# Altium schematic sheet MCU025B_Hardware.SchDoc
size 431 x 279 mm; Date: Not shown in title block; ApprovedBy: Not shown in title block; CheckedBy: Not shown in title block; Author: Not shown in title block; CompanyName: Not shown in title block; Engineer: Not shown in title block; Organization: Not shown in title block; Address1: Not shown in title block; Address2: Not shown in title block; Address3: Not shown in title block; Address4: Not shown in title block; DocumentNumber: 8; Revision: Use project parameter SCH_Rev; SheetNumber: 8; SheetTotal: 8; PageSetup: Record=PageOptions|CenterHorizontal=True|CenterVertical=True|PrintScale=1.00|XCorrection=1.00|YCorrection=1.00|PrintKind=0|BorderSize=5000000|LeftOffset=0|BottomOffset=0|Orientation=2|PaperLength=1000|PaperWidth=1000|Scale=100|PaperSource=15|PrintQuality=600|MediaType=1|DitherType=10|PaperKind=Letter|PrintScaleMode=1; CurrentTime: Not shown in title block; CurrentDate: Not shown in title block; Time: Not shown in title block; DocumentFullPathAndName: Not shown in title block; DocumentName: Not shown in title block; ModifiedDate: Not shown in title block; ImagePath: Not shown in title block
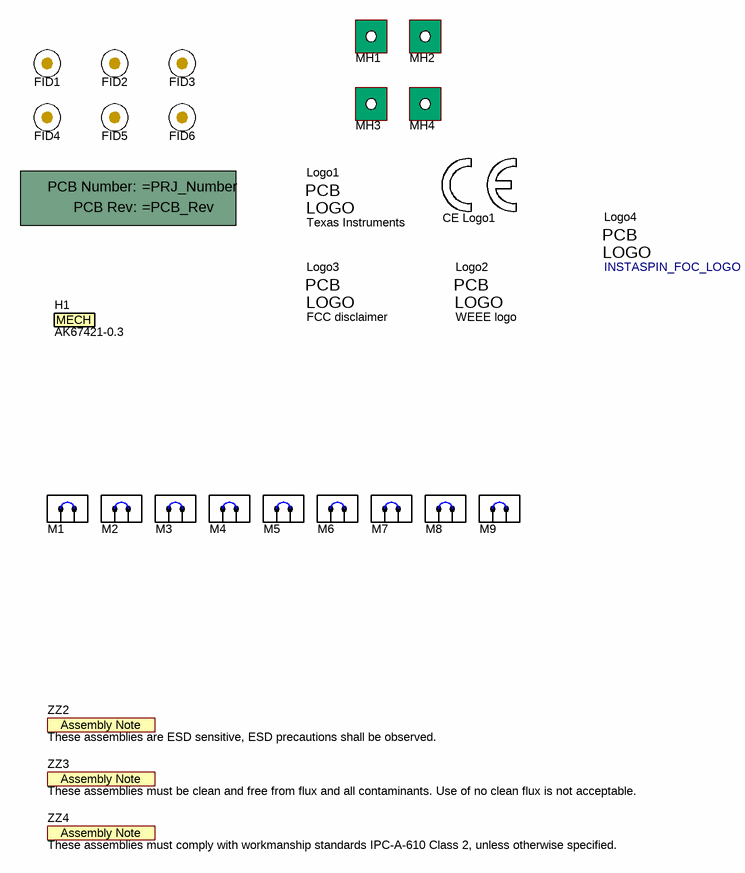
[diagram p0: MCU025B_Hardware.SchDoc]

## Parts
!PCB1  Printed Circuit Board  (value not drawn)  (mechanical)
CE_Logo1  CE Mark  [CE_Mark_5mm]  (value not drawn)  (no BOM)
FID1  Fiducial  [Fiducial10-20]  (value not drawn)  (no BOM)
FID2  Fiducial  [Fiducial10-20]  (value not drawn)  (no BOM)
FID3  Fiducial  [Fiducial10-20]  (value not drawn)  (no BOM)
FID4  Fiducial  [Fiducial10-20]  (value not drawn)  (no BOM)
FID5  Fiducial  [Fiducial10-20]  (value not drawn)  (no BOM)
FID6  Fiducial  [Fiducial10-20]  (value not drawn)  (no BOM)
H1  AK67421-0.3  (mechanical)
Logo1  Texas Instruments  [TI_Stacked_Overlay_Small]  (no BOM)
Logo2  WEEE logo  [WEEE_Minimum]  (no BOM)
Logo3  FCC disclaimer  [FCC_disclaimer]  (no BOM)
Logo4  INSTASPIN_FOC_LOGO  [INSTASPIN_FOC_LOGO]  (no BOM)
M1  60900213421  [Wurth_60900213421]  (value not drawn)
M2  60900213421  [Wurth_60900213421]  (value not drawn)
M3  60900213421  [Wurth_60900213421]  (value not drawn)
M4  60900213421  [Wurth_60900213421]  (value not drawn)
M5  60900213421  [Wurth_60900213421]  (value not drawn)
M6  60900213421  [Wurth_60900213421]  (value not drawn)
M7  60900213421  [Wurth_60900213421]  (value not drawn)
M8  60900213421  [Wurth_60900213421]  (value not drawn)
M9  60900213421  [Wurth_60900213421]  (value not drawn)
MH1  MTG_NoPads  [NPTH125mil]  (value not drawn)  (no BOM)
MH2  MTG_NoPads  [NPTH125mil]  (value not drawn)  (no BOM)
MH3  MTG_NoPads  [NPTH125mil]  (value not drawn)  (no BOM)
MH4  MTG_NoPads  [NPTH125mil]  (value not drawn)  (no BOM)
ZZ2  These assemblies are ESD sensitive, ESD precautions shall be observed.  [AssemblyNote]  (no BOM)
ZZ3  These assemblies must be clean and free from flux and all contaminants. Use of no clean flux is not acceptable.  [AssemblyNote]  (no BOM)
ZZ4  These assemblies must comply with workmanship standards IPC-A-610 Class 2, unless otherwise specified.  [AssemblyNote]  (no BOM)

## Notes on the sheet
- Drawn By:
- SVN Rev:
- Number:
- TID #:
- Orderable:
- Rev:
- Sheet Title:
- File:
- Project Title:
- Designed for:
- Assembly Variant:
- Mod. Date:
- Sheet:
- Size:
- of
- B
- http://www.ti.com
- Texas Instruments and/or its licensors do not warrant the accuracy or completeness of this specification or any information contained therein. Texas Instruments and/or its licensors do not warrant that this design will meet the specifications, will be suitable for your application or fit for any particular purpose, or will operate in an implementation. Texas Instruments and/or its licensors do not warrant that the design is production worthy. You should completely validate and test your design implementation to confirm the system functionality for your application.
- Engineer:
- Contact:
- © Texas Instruments
- (in symbol CMP-0003618-2) PCB Number:; PCB Rev:
- (in symbol CMP-0074769-1) PCB; LOGO
- (in symbol CMP-0074838-1) PCB; LOGO
- (in symbol CMP-0074847-1) PCB; LOGO
- (in symbol CMP-0077983-1) MECH
- (in symbol CMP-0861049-2) PCB; LOGO

## Library data of the parts
!PCB1 = CMP-0003618-2: Manufacturer: Any; CompType: PCB; PartNumber: =PRJ_Number; RoHS: O; MountType: N/A; Publisher: Texas Instruments; LatestRevisionDate: 2017-03-09; Key: PCB
CE_Logo1 = CMP-0074844-1: SymbolCreator: a0412235; Published: 2009-03-03; Publisher: Texas Instruments; LatestRevisionDate: 2017-07-06; Lib Reference: CE Mark; PartNumber: CE Mark; Library Reference: CE Mark
FID1-FID6 = CMP-0077181-1: Fiducial mark.  There is nothing to buy or mount.; CompType: Fiducial; Manufacturer: N/A; MountType: N/A; PackageReference: N/A; PartNumber: N/A; ClassName: FiducialMark; Library Reference: Fiducial
H1 = CMP-0077983-1: Cable, USB-A to micro USB-B, 0.3 m; Manufacturer: Assman WSW; ComponentLink1URL: http://www.assmann-wsw.com/fileadmin/datasheets/ASS_7091_CA.pdf; Key: AK67421-0.3; CompType: Cable; Supplier 1: Digi-Key; RoHS: Y; Supplier Part Number 1: AE11229-ND; PartNumber: AK67421-0.3; MountType: N/A; ComponentLink1Description: Datasheet Link
Logo1 = CMP-0074838-1: Texas Instrument Corporate Signature; SymbolCreator: a0412235; Lib Reference: TI_Logo; Library Reference: Logo; SymbolVersion: 2011-08-22; Published: 2009-03-03; Publisher: Texas Instruments; ClassName: Logo; LatestRevisionDate: 2017-07-06; PartNumber: Texas Instruments
Logo2 = CMP-0074769-1: Library Reference: WEEE logo; Lib Reference: WEEE logo; PartNumber: WEEE logo
Logo3 = CMP-0074847-1: FCC_disclaimer; Library Reference: Logo; Published: 2009-03-03; Publisher: Texas Instruments; LatestRevisionDate: 2017-07-06; Lib Reference: FCC_disclaimer; PartNumber: FCC disclaimer
Logo4 = CMP-0861049-2: INSTASPIN FOC LOGO; Published: 2009-03-03; Publisher: Texas Instruments; ClassName: Logo; Lib Reference: INSTASPIN_FOC_LOGO; Library Reference: Logo; LatestRevisionDate: 2019-11-13
M1-M9 = CMP-0003761-2: Shunt, 2.54mm, Gold, Black; Manufacturer: Wurth Elektronik; ComponentLink1URL: http://katalog.we-online.de/em/datasheet/60900213421.pdf; Supplier Part Number 2: 16T0609; Supplier 3: Mouser; Supplier 1: Digi-Key; CompType: Shunt; PackageReference: Shunt, 2.54mm, Black; RoHS: Y; Supplier Part Number 1: 732-2678-ND; Supplier Part Number 3: 710-60900213421; Supplier 2: Newark; MountType: N/A; PartNumber: 60900213421; ComponentLink1Description: Datasheet Link; ClassName: Shunt
MH1-MH4 = CMP-0078424-2: PCB Mounting Hole, No Pad; Manufacturer: Any; Key: Mounting Hole (non-standard) No Pad; CompType: Mounting Hole; PartNumber: N/A; PackageReference: Mounting Hole; MountType: N/A
ZZ2 = CMP-0077236-1: CompType: AssemblyNote; ClassName: AssemblyNote; Publisher: Texas Instruments; LatestRevisionDate: 2017-08-10; Key: AssemblyNote
ZZ3 = CMP-0077237-1: CompType: AssemblyNote; ClassName: AssemblyNote; Publisher: Texas Instruments; LatestRevisionDate: 2017-08-10; Key: AssemblyNote
ZZ4 = CMP-0077238-1: CompType: AssemblyNote; ClassName: AssemblyNote; Publisher: Texas Instruments; LatestRevisionDate: 2017-08-10; Key: AssemblyNote